# EAGLE design ConnectBoard (EAGLE 9.4.2)
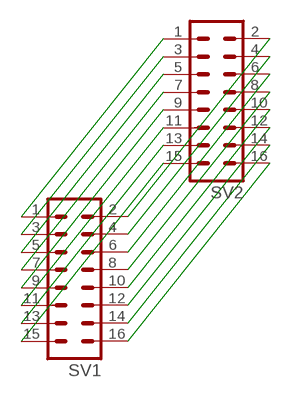
[diagram p0: schematic, sheet 1]

## Parts
SV1  ML16  [ML16]
SV2  ML16  [ML16]

## Nets
N$1: SV1.1 SV2.1
N$2: SV1.3 SV2.3
N$3: SV1.5 SV2.5
N$4: SV1.7 SV2.7
N$5: SV1.9 SV2.9
N$6: SV1.11 SV2.11
N$7: SV1.13 SV2.13
N$8: SV1.15 SV2.15
N$9: SV1.2 SV2.2
N$10: SV1.4 SV2.4
N$11: SV1.6 SV2.6
N$12: SV1.8 SV2.8
N$13: SV1.10 SV2.10
N$14: SV1.12 SV2.12
N$15: SV1.14 SV2.14
N$16: SV1.16 SV2.16

## Library data of the parts
SV1 SV2 = con-ml:ML16: HARTING; OC_FARNELL: unknown; OC_NEWARK: unknown

## Board
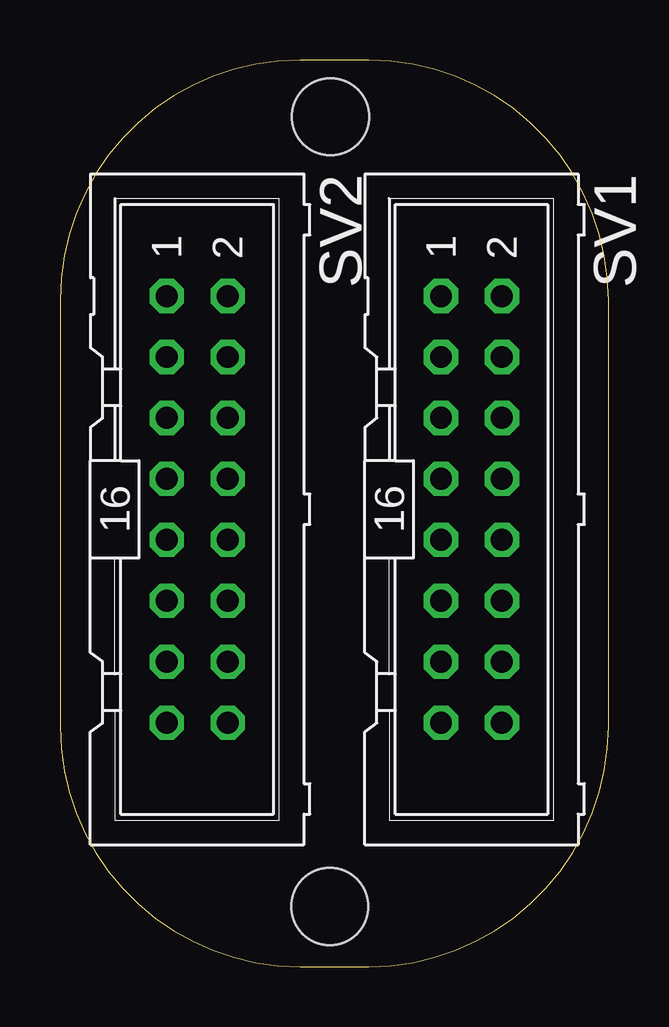
[diagram p1: board, top side]
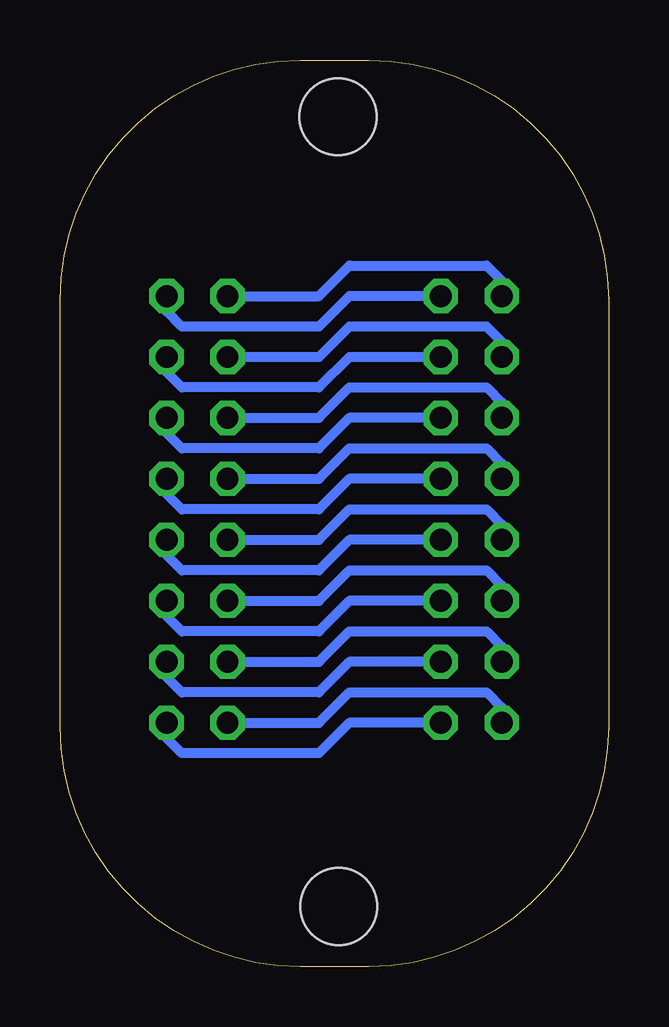
[diagram p2: board, bottom side, seen from below]

Size 22.86 x 37.77 mm. Coordinates in mm from the lower left corner, seen from the top.
Outline: 0,27.77 0,10 arc90 10,0 12.86,0 arc90 22.86,10 22.86,27.77 arc90 12.86,37.77 10,37.77 arc90 0,27.77
Copper layers (1*16): Top 0.035mm / dielectric 1.5mm / Bottom 0.035mm
Design rules "default": minimum track width 6mil, minimum drill 0.35mm, track to track 6mil, track to pad 6mil, pad to pad 6mil, via to via 6mil, smd to smd 6mil, copper to edge 40mil, drill to drill 6mil, minimum pad ring 10mil, minimum via ring 8mil, stop-mask expansion 4mil, vias tented up to drill 0mil, thermal gap 10mil
Holes 3.2 mm at 11.23,2.5 11.27,35.41

### Footprints (pad centres in the part's own frame; a part is rotated, then mirrored left to right if it is on the bottom)
ML16 = drill 0.914 octagon: 1 -8.89,-1.27; 2 -8.89,1.27; 3 -6.35,-1.27; 4 -6.35,1.27; 5 -3.81,-1.27; 6 -3.81,1.27; 7 -1.27,-1.27; 8 -1.27,1.27; 9 1.27,-1.27; 10 1.27,1.27; 11 3.81,-1.27; 12 3.81,1.27; 13 6.35,-1.27; 14 6.35,1.27; 15 8.89,-1.27; 16 8.89,1.27

### Placement (x,y rotation side)
SV1  17.14,19.05 270 top
SV2  5.71,19.05 270 top

### Tracks (layer width: path | path; a pad name or v marks a point on that pad's centre or on a via)
N$1
  Bottom 0.406: SV2.1 4.45,28.57 5.08,29.21 10.79,29.21 12.06,27.94 SV1.1
N$2
  Bottom 0.406: SV2.3 4.45,26.04 5.08,26.67 10.79,26.67 12.06,25.4 SV1.3
N$3
  Bottom 0.406: SV1.5 12.06,22.86 10.79,24.13 5.08,24.13 4.45,23.5 SV2.5
N$4
  Bottom 0.406: SV1.7 12.06,20.32 10.79,21.59 5.08,21.59 4.45,20.95 SV2.7
N$5
  Bottom 0.406: SV1.9 12.06,17.78 10.79,19.05 5.08,19.05 4.45,18.41 SV2.9
N$6
  Bottom 0.406: SV1.11 12.06,15.24 10.79,16.51 5.08,16.51 4.45,15.88 SV2.11
N$7
  Bottom 0.406: SV1.13 12.06,12.7 10.79,13.97 5.08,13.97 4.45,13.34 SV2.13
N$8
  Bottom 0.406: SV1.15 12.06,10.16 10.79,11.43 5.08,11.43 4.45,10.79 SV2.15
N$9
  Bottom 0.406: SV2.2 10.79,27.94 12.06,26.67 17.78,26.67 18.41,27.3 SV1.2
N$10
  Bottom 0.406: SV2.4 10.79,25.4 12.06,24.13 17.78,24.13 18.41,24.77 SV1.4
N$11
  Bottom 0.406: SV2.6 10.79,22.86 12.06,21.59 17.78,21.59 18.41,22.23 SV1.6
N$12
  Bottom 0.406: SV2.8 10.79,20.32 12.06,19.05 17.78,19.05 18.41,19.68 SV1.8
N$13
  Bottom 0.406: SV2.10 10.79,17.78 12.06,16.51 17.78,16.51 18.41,17.14 SV1.10
N$14
  Bottom 0.406: SV2.12 10.79,15.24 12.06,13.97 17.78,13.97 18.41,14.61 SV1.12
N$15
  Bottom 0.406: SV2.14 10.79,12.7 12.06,11.43 17.78,11.43 18.41,12.06 SV1.14
N$16
  Bottom 0.406: SV2.16 10.79,10.16 12.06,8.89 17.78,8.89 18.41,9.53 SV1.16